# EAGLE design sensor_board (EAGLE 7.3.0)
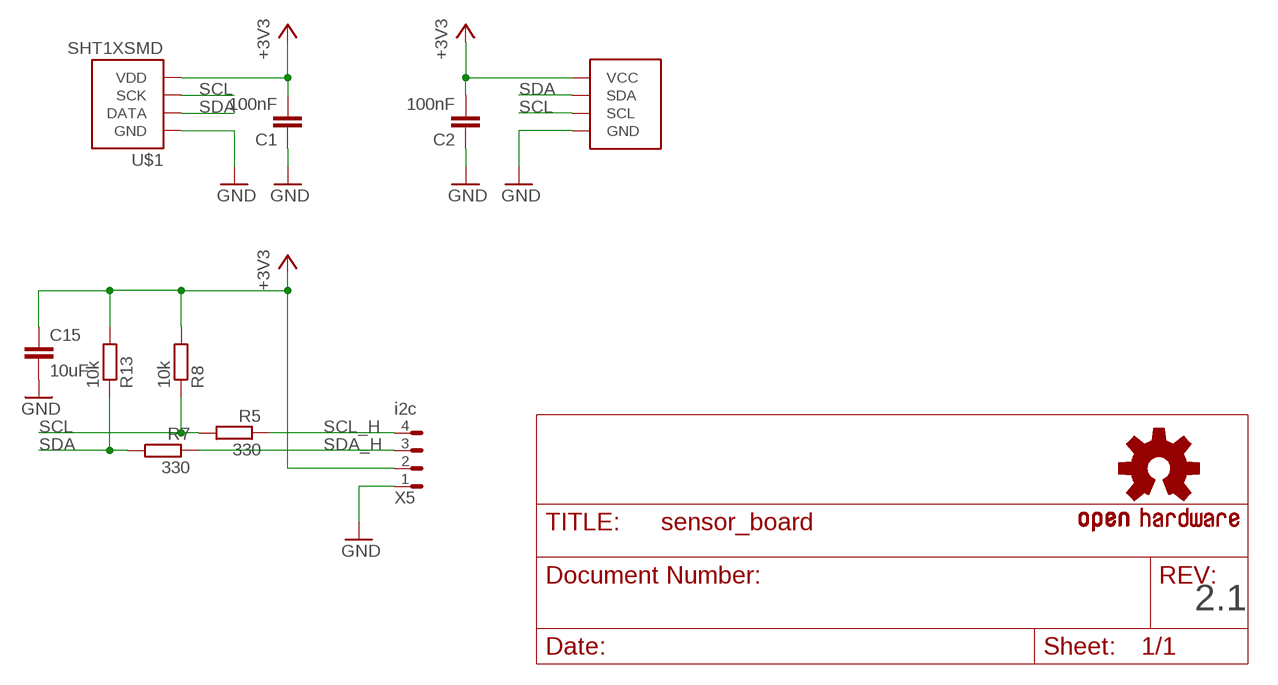
[diagram p0: schematic, sheet 1]

## Parts
C1  100nF  C-EUC0805  [C0805]
C2  100nF  C-EUC0805  [C0805]
C15  10uF  C-EUC1206  [C1206]
R5  330  R-EU_R0805W  [R0805W]
R7  330  R-EU_R0805W  [R0805W]
R8  10k  R-EU_R0805W  [R0805W]
R13  10k  R-EU_R0805W  [R0805W]
U$1  SHT1XSMD  [SHT1X]
U$2  HONEYWELL_HSC  [HONEYWELL_8_SMT]
U$7  OSHW-LOGOM  [OSHW-LOGO-M]
X5  i2c  MOLEX_4HORIZONTAL  [0530480401]

## Nets
+3V3: C1.2 C2.2 C15.1 R8.2 R13.2 U$1.4(VDD) U$2.P$2(VCC) X5.2
GND: C1.1 C2.1 C15.2 U$1.1(GND) U$2.P$1(GND) X5.1
SCL: R5.2 R8.1 U$1.3(SCK) U$2.P$4(SCL)
SCL_H: R5.1 X5.4
SDA: R7.2 R13.1 U$1.2(DATA) U$2.P$3(SDA)
SDA_H: R7.1 X5.3

## Notes on the sheet
- 2.1

## Library data of the parts
C1 C2 C15 = rcl:C-EU: CAPACITOR, European symbol
R5 R7 R8 R13 = rcl:R-EU_: RESISTOR, European symbol
U$1 = SparkFun-Sensors:SHT1X: SHT1x Humdity Sensor Sensirion humdity sensor. Schematic element and footprint proven. Spark Fun Electronics SKU : COM-08227; PROD_ID: IC-08303
U$2 = Simplex-ICs:HONEYWELL_HSC: Honeywell HSCMRNN sensors
U$7 = SparkFun:OSHW-LOGO: Open Source Hardware Logo This logo indicates the piece of hardware it is found on incorporates a OSHW license and/or adheres to the definition of open source hardware found here: http://freedomdefined.org/OSHW
X5 = Simplex-Connectors:MOLEX_4: Molex 4 pin connectors 1.25mm PicoBlade

## Net classes
1 vcc: width 0.203 mm

## Board
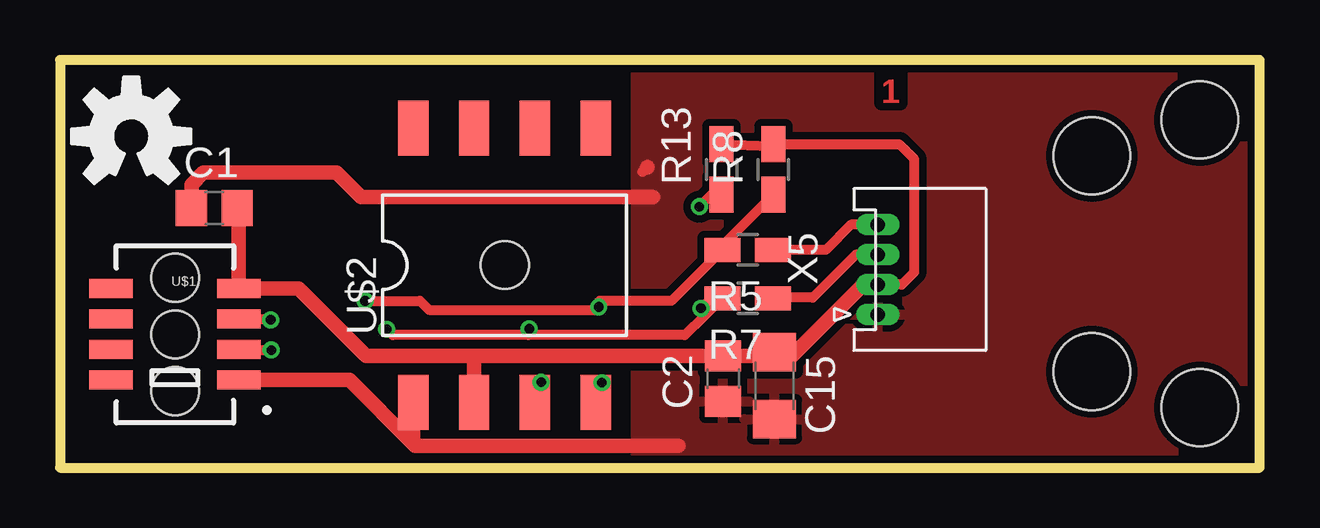
[diagram p1: board, top side]
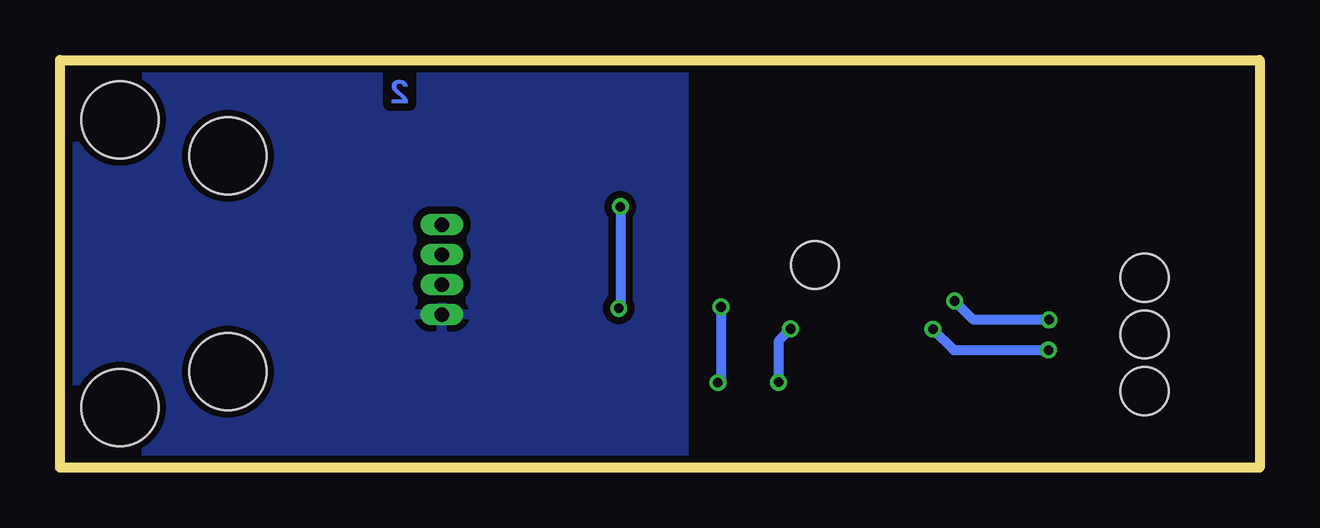
[diagram p2: board, bottom side, seen from below]

Size 50.01 x 17 mm. Coordinates in mm from the lower left corner, seen from the top.
Outline: 0.01,0 50.01,0 50.01,17 0,17 0.01,0
Copper layers (1*16): Top 0.035mm / dielectric 1.5mm / Bottom 0.035mm
Design rules "seeed_2-layer_20140221": minimum track width 6mil, minimum drill 12mil, track to track 6mil, track to pad 6mil, pad to pad 6mil, via to via 6mil, smd to smd 0mil, copper to edge 10mil, drill to drill 10mil, minimum pad ring 6mil, minimum via ring 6mil, stop-mask expansion 2mil, vias tented up to drill 100mil, thermal gap 10mil
Holes 3.2 mm at 47.51,14.5 47.51,2.5 43.01,13 43.01,4
Holes 2 mm at 4.8,3.19 18.54,8.45 4.8,5.55 4.8,7.92

### Footprints (pad centres in the part's own frame; a part is rotated, then mirrored left to right if it is on the bottom)
C0805 = smd 1.3 x 1.5: 1 -0.95,0; 2 0.95,0
C1206 = smd 1.6 x 1.8: 1 -1.4,0; 2 1.4,0
R0805W = smd 1.5 x 1: 1 -1.052,0; 2 1.052,0
SHT1X = smd 1.8 x 0.8: 1 -2.667,1.905; 2 -2.667,0.635; 3 -2.667,-0.635; 4 -2.667,-1.905; 5 2.667,-1.905; 6 2.667,-0.635; 7 2.667,0.635; 8 2.667,1.905
HONEYWELL_8_SMT = smd 1.27 x 2.286: P$1 -3.81,-5.716; P$2 -1.27,-5.716; P$3 1.27,-5.716; P$4 3.81,-5.716; P$5 3.81,5.716; P$6 1.27,5.716; P$7 -1.27,5.716; P$8 -3.81,5.716
0530480401 = drill 0.6 pad 0.9 long: 1 0,0; 2 1.25,0; 3 2.5,0; 4 3.75,0

### Placement (x,y rotation side)
C1  6.43,10.82 0 top
C2  27.64,3.71 90 top
C15  29.78,3.42 270 top
R5  28.67,9.08 180 top
R7  28.67,7.06 180 top
R8  29.73,12.43 90 top
R13  27.58,12.43 90 top
U$1  4.79,5.56 180 top
U$2  18.53,8.44 0 top
U$7  2.97,13.81 0 top
X5  34.09,6.38 90 top

### Tracks (layer width: path | path; a pad name or v marks a point on that pad's centre or on a via)
+3V3
  Top 0.406: R13.2 29.66,13.41 R8.2 34.99,13.48 35.61,12.86 35.61,8.15 35.09,7.63 X5.2 | U$2.P$2
  Top 0.61: X5.2 33.48,7.63 30.51,4.66 29.8,4.66 | 29.8,4.66 C2.2 17.4,4.66 | C15.1 29.8,4.8 29.8,4.66 | 17.4,4.66 12.76,4.66 9.96,7.46 U$1.4 7.46,11.1 C1.2 | U$2.P$2 17.25,4.51 17.4,4.66
GND
  Top 0.406: 24.28,12.33 24.48,12.53 | 14.76,0.96 14.72,0.96
  Top 0.61: 25.79,0.91 14.81,0.91 14.76,0.96 14.72,1 | 24.46,12.51 24.48,12.53 | U$2.P$1 14.72,1 | 14.72,1 12.06,3.65 U$1.1 | C1.1 5.48,11.81 5.97,12.3 11.54,12.3 12.55,11.29 24.67,11.29 24.72,11.29
  pour Top (isolate 0.305): 24.01,17 50.01,17 50.01,0 24.01,0
  pour Bottom (isolate 0.305): 24.01,17 50.01,17 50.01,0 24.01,0
SCL  (via drill 0.4)
  Top 0.406: U$1.3 8.74,6.2 v8.78,6.16 | 22.38,3.33 v22.59,3.54 22.59,2.72 U$2.P$4 | R8.1 27.62,9.27 R5.2 25.49,6.95 22.49,6.95 22.46,6.92 v22.46,6.7 22.34,6.58 15.38,6.58 15.01,6.95 v12.72,6.95
  Bottom 0.406: v8.78,6.16 11.93,6.16 v12.72,6.95 | v22.46,6.7 22.46,3.67 v22.59,3.54
SCL_H
  Top 0.406: X5.4 32.97,10.13 31.92,9.08 R5.1
SDA  (via drill 0.4)
  Top 0.406: 19.52,5.53 26.05,5.53 R7.2 27.14,7.06 v26.72,6.64 | 19.52,5.53 13.87,5.53 v13.62,5.78 v13.62,5.77 | 19.84,3.34 v20.06,3.56 20.06,2.72 U$2.P$3 | v19.56,5.78 19.52,5.74 19.52,5.53 | U$1.2 7.48,4.9 v8.81,4.9 | R13.1 27.15,11.38 v26.65,10.88
  Bottom 0.406: v19.56,5.78 20.06,5.28 v20.06,3.56 | v13.62,5.77 12.75,4.9 v8.81,4.9 | v26.65,10.88 26.65,6.71 v26.72,6.64
SDA_H
  Top 0.406: X5.3 33.17,8.88 31.38,7.09 29.71,7.09 R7.1

### Text on the board
Top: 1
Bottom: 2
tmine: i2c